# EAGLE design schematic (EAGLE 9.6.2)
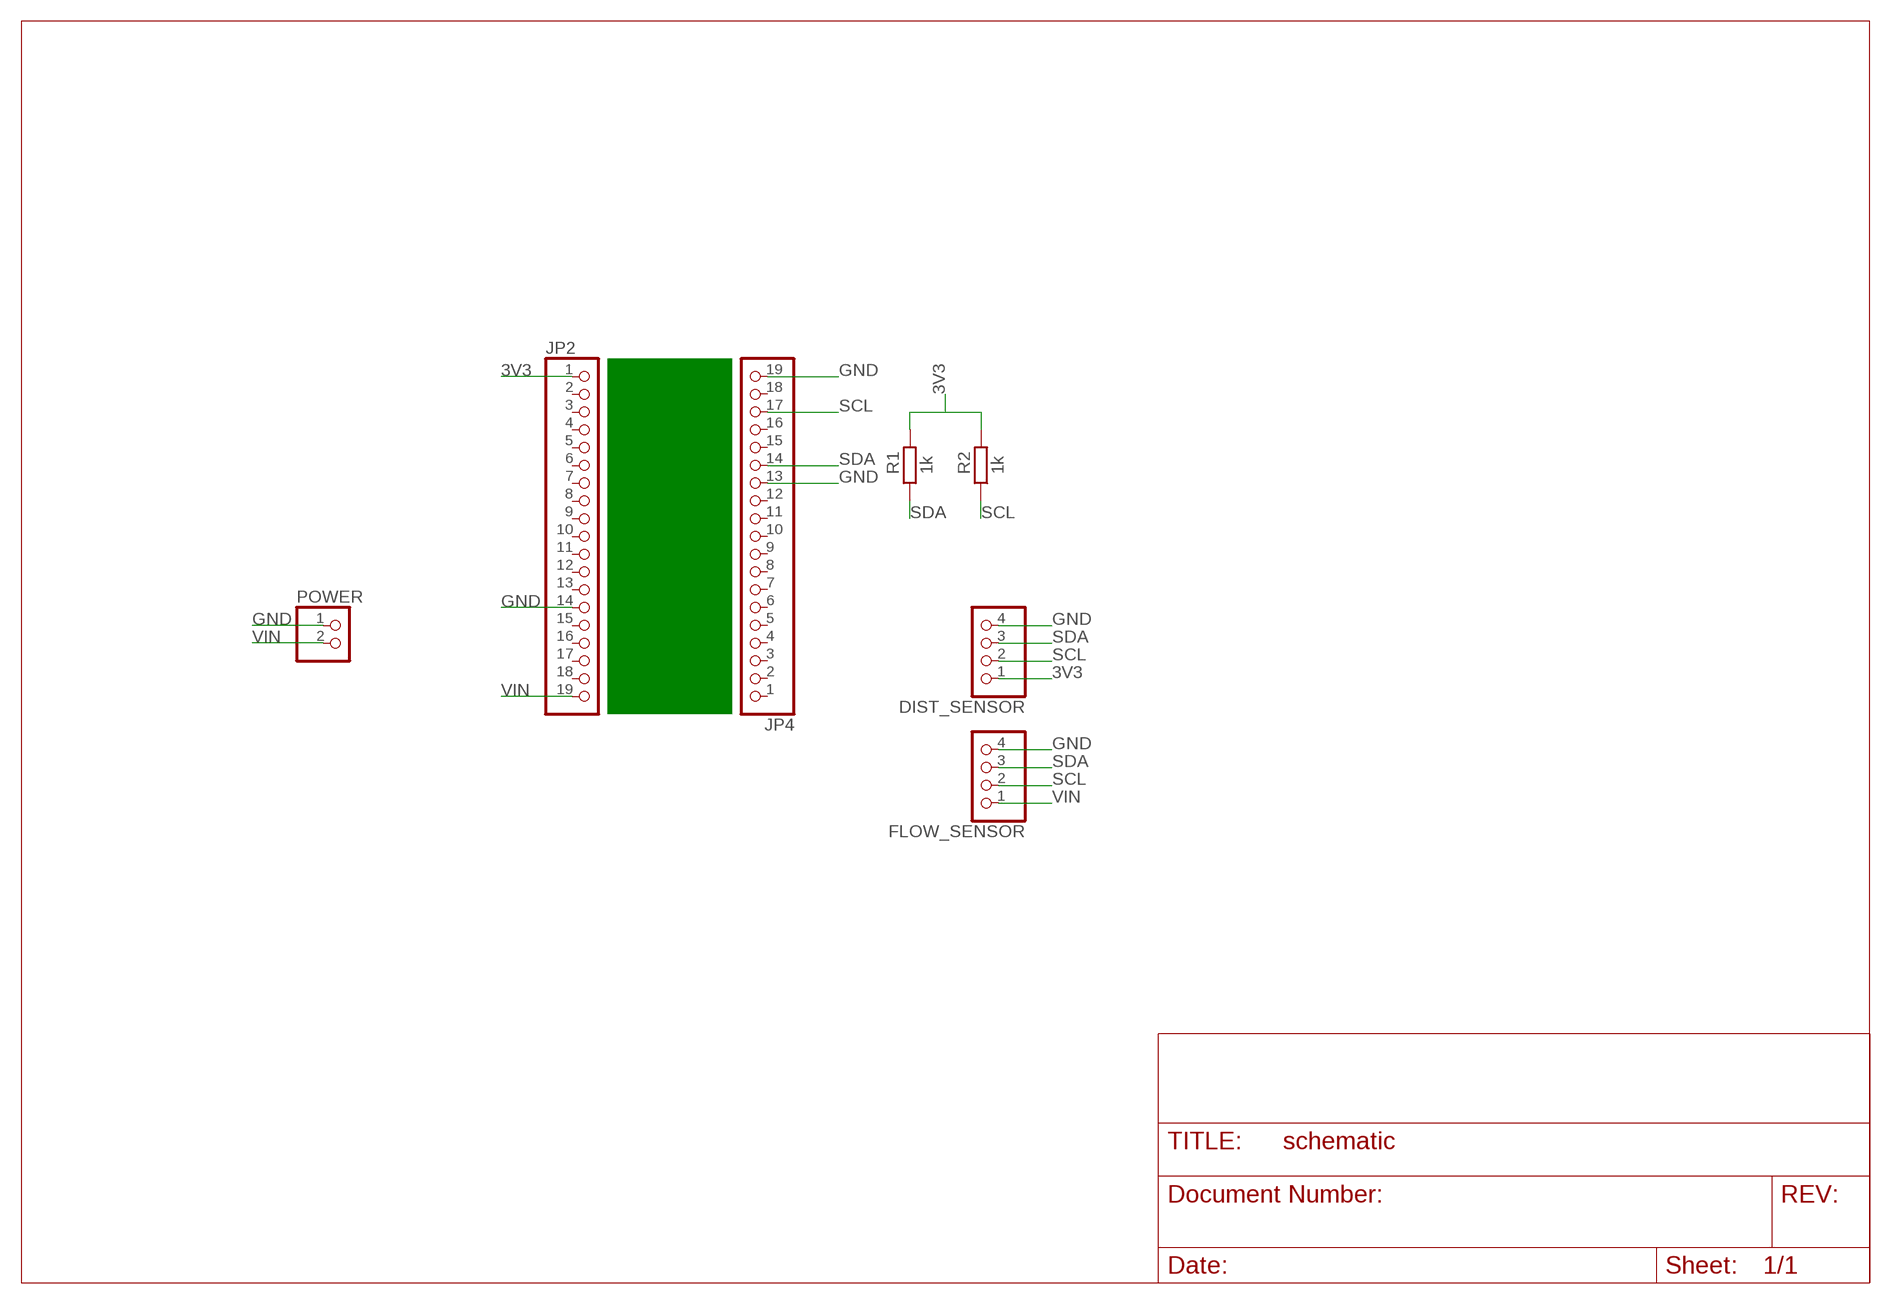
[diagram p0: schematic, sheet 1]

## Parts
DIST_SENSOR  PINHD-1X4  [1X04]
FLOW_SENSOR  PINHD-1X4  [1X04]
JP2  PINHD-1X19  [1X19]
JP4  PINHD-1X19  [1X19]
POWER  PINHD-1X2  [1X02]
R1  1k  R-EU_0207/10  [0207/10]
R2  1k  R-EU_0207/10  [0207/10]

## Nets
3V3: DIST_SENSOR.1 JP2.1 R1.2 R2.2
GND: DIST_SENSOR.4 FLOW_SENSOR.4 JP2.14 JP4.13 JP4.19 POWER.1
SCL: DIST_SENSOR.3 FLOW_SENSOR.3 JP4.17 R2.1
SDA: DIST_SENSOR.2 FLOW_SENSOR.2 JP4.14 R1.1
VIN: FLOW_SENSOR.1 JP2.19 POWER.2
Unconnected: JP2.2 JP2.3 JP2.4 JP2.5 JP2.6 JP2.7 JP2.8 JP2.9 JP2.10 JP2.11 JP2.12 JP2.13 JP2.15 JP2.16 JP2.17 JP2.18 JP4.1 JP4.2 JP4.3 JP4.4 JP4.5 JP4.6 JP4.7 JP4.8 JP4.9 JP4.10 JP4.11 JP4.12 JP4.15 JP4.16 JP4.18

## Library data of the parts
DIST_SENSOR FLOW_SENSOR = pinhead:PINHD-1X4: PIN HEADER
JP2 JP4 = pinhead:PINHD-1X19: PIN HEADER
POWER = pinhead:PINHD-1X2: PIN HEADER
R1 R2 = rcl:R-EU_: RESISTOR, European symbol; SPICEPREFIX: R

## Board
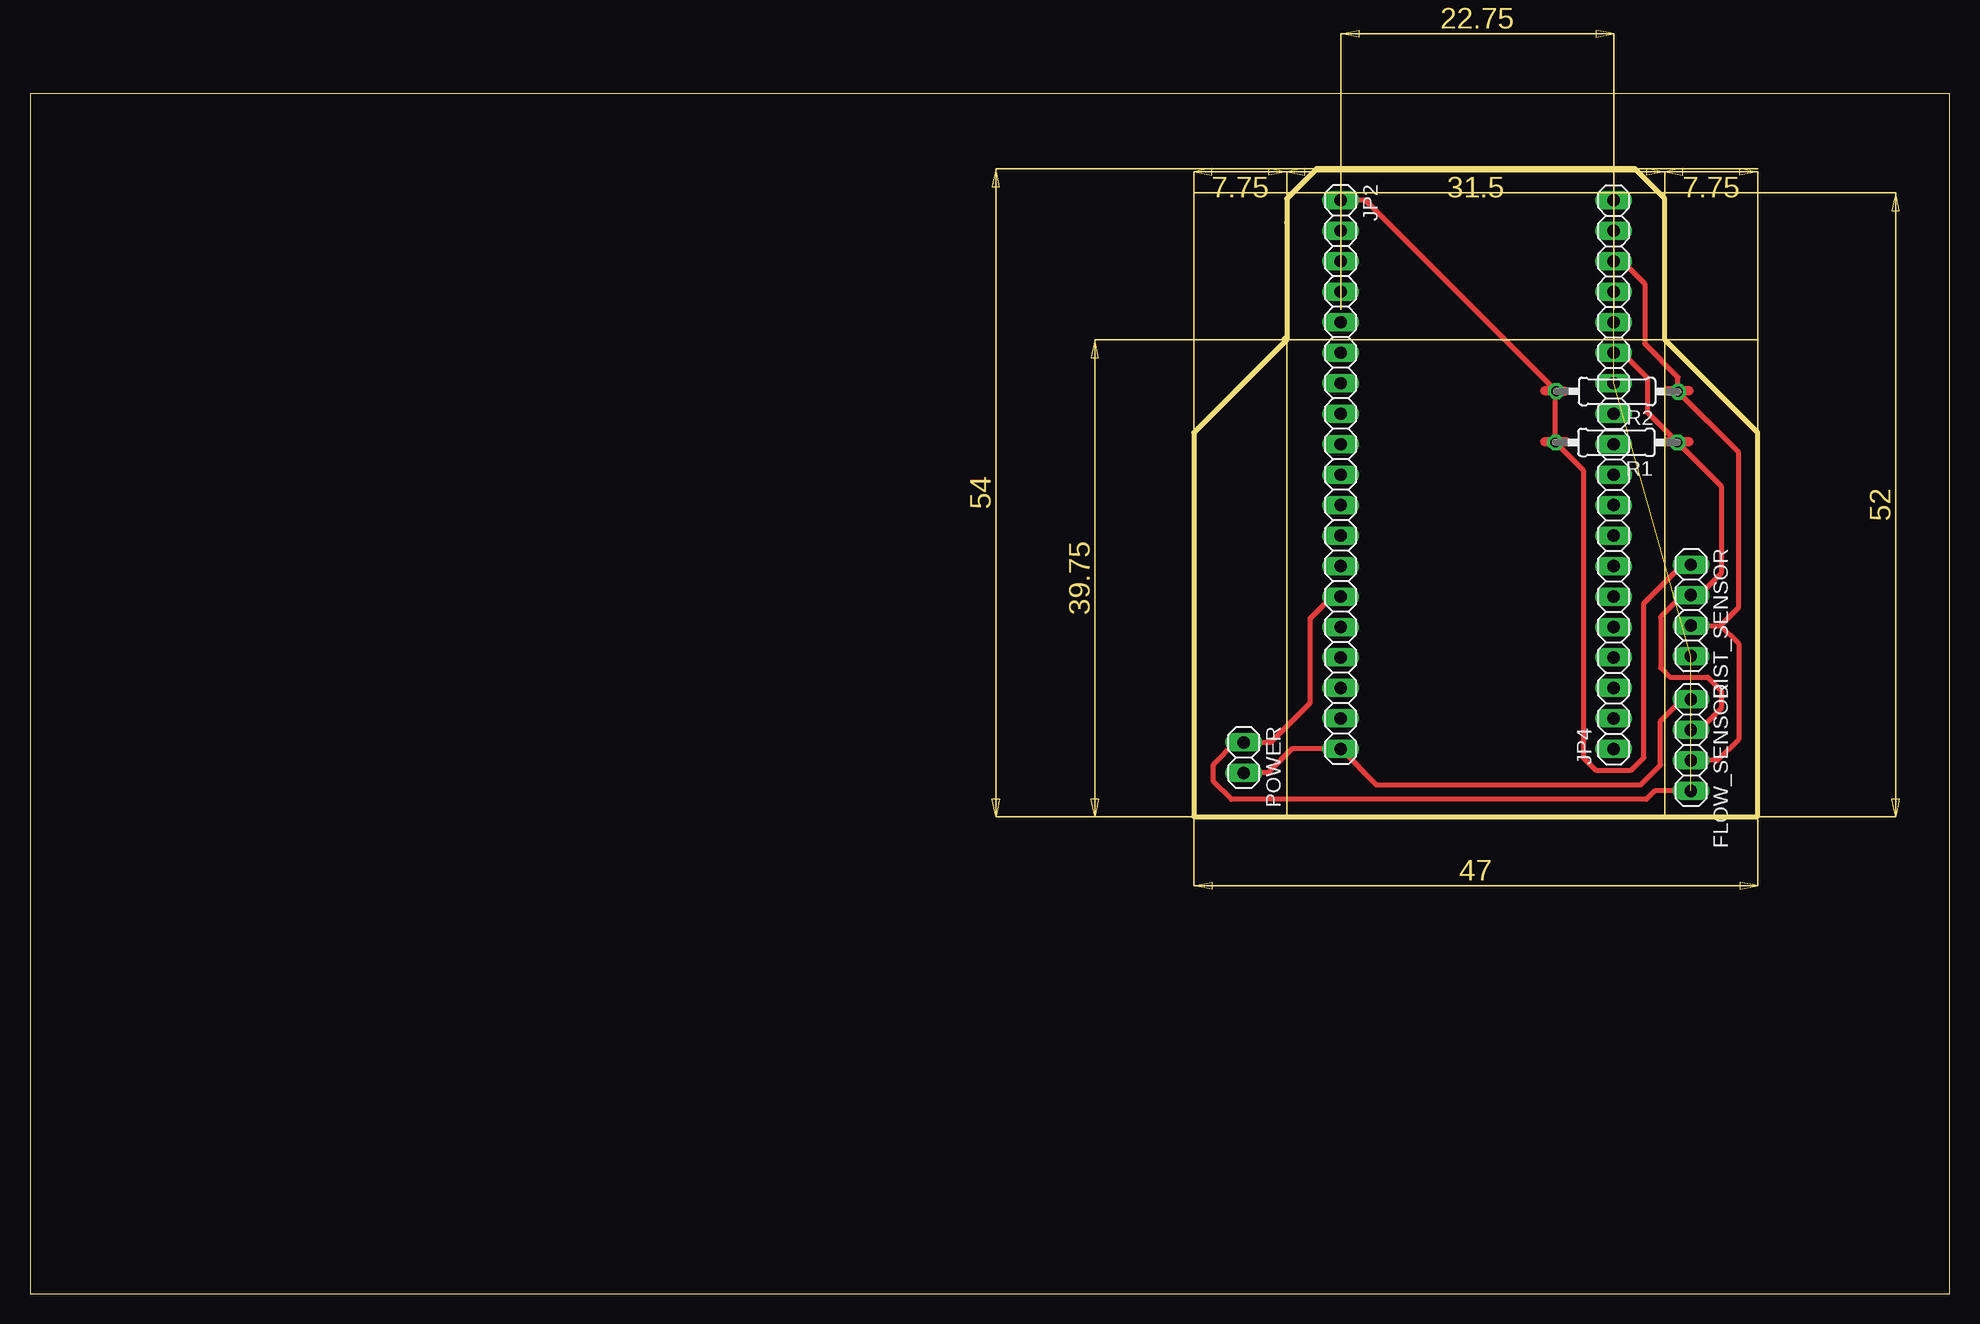
[diagram p1: board, top side]

Size 160 x 100 mm. Coordinates in mm from the lower left corner, seen from the top.
Outline: 104.75,89.25 104.75,79.5 97,71.75 97,39.75 144,39.75 144,71.75 136.25,79.5 136.25,91.25 133.75,93.75 107.25,93.75 104.75,91.25 104.75,79.75 104.5,79.5
Outline: 0,0 160,0 160,100 0,100 0,0
Copper layers (1*16): Top 0.035mm / dielectric 1.5mm / Bottom 0.035mm
Design rules "default *": minimum track width 0.4mm, minimum drill 0.35mm, track to track 0.8mm, track to pad 0.8mm, pad to pad 0.8mm, via to via 0.8mm, smd to smd 0.4mm, copper to edge 40mil, drill to drill 6mil, minimum pad ring 10mil, minimum via ring 8mil, stop-mask expansion 4mil, vias tented up to drill 0mil, thermal gap 10mil

### Footprints (pad centres in the part's own frame; a part is rotated, then mirrored left to right if it is on the bottom)
1X04 = drill 1.016 long: 1 -3.81,0; 2 -1.27,0; 3 1.27,0; 4 3.81,0
1X19 = drill 1.016 long: 1 -22.86,0; 2 -20.32,0; 3 -17.78,0; 4 -15.24,0; 5 -12.7,0; 6 -10.16,0; 7 -7.62,0; 8 -5.08,0; 9 -2.54,0; 10 0,0; 11 2.54,0; 12 5.08,0; 13 7.62,0; 14 10.16,0; 15 12.7,0; 16 15.24,0; 17 17.78,0; 18 20.32,0; 19 22.86,0
1X02 = drill 1.016 long: 1 -1.27,0; 2 1.27,0
0207/10 = drill 0.813 octagon: 1 -5.08,0; 2 5.08,0

### Placement (x,y rotation side)
DIST_SENSOR  138.45,56.94 270 top
FLOW_SENSOR  138.45,45.7 270 top
JP2  109.25,68.25 270 top
JP4  132,68.25 90 top
POWER  101.17,44.66 270 top
R1  132.23,70.93 180 top
R2  132.29,75.18 179.8 top

### Tracks (layer width: path | path; a pad name or v marks a point on that pad's centre or on a via)
3V3
  Top 0.4: R1.2 127.15,75.14 R2.2 | R2.2 111.3,91.11 JP2.1 | R1.2 129.48,68.6 129.48,44.66 130.51,43.63 133.49,43.63 134.52,44.66 134.52,57.54 137.74,60.75 DIST_SENSOR.1 | R1.2 127.08,71 | R1.2 127.22,71 | R2.2 127.26,75.25 128,75.25 127.95,75.2 | R2.2 127.16,75.25
  Top 0.8: 127.08,71 126.25,71 | 128,71 127.22,71 | 127.95,75.2 R2.2 | 127.16,75.25 126.25,75.25
GND  (3 unrouted)
  Top 0.4: 138.2,41.64 FLOW_SENSOR.4 135.45,41.89 134.74,41.18 100.13,41.18 98.65,42.66 98.65,44.12 100.46,45.93 POWER.1 103.42,45.93 106.73,49.24 106.73,56.28 108.54,58.09 JP2.14
SCL
  Top 0.4: FLOW_SENSOR.3 140.66,44.43 142.47,46.24 142.47,54.11 140.91,55.67 | 140.91,55.67 142.42,57.18 142.42,70.11 R2.1 | DIST_SENSOR.3 140.91,55.67 | JP4.17 132.71,86.03 134.58,84.16 134.58,79.16 137.37,76.38 R2.1 | 137.46,75.25 R2.1 | R2.1 137.28,75.25
  Top 0.8: 138.25,75.25 137.46,75.25 | 137.28,75.25 136.51,75.25
SDA  (1 unrouted)
  Top 0.4: 138.48,47 139.19,47 140.97,48.78 140.97,50.24 139.85,51.37 136.71,51.37 135.93,52.15 135.93,56.4 137.74,58.21 DIST_SENSOR.2 139.16,58.21 140.97,60.02 140.97,67.27 R1.1 134.81,73.43 134.81,76.31 132.71,78.41 JP4.14
  Top 0.8: 136.5,71 137.24,71 R1.1 137.38,71 138.25,71
VIN
  Top 0.4: FLOW_SENSOR.1 137.74,49.51 135.9,47.68 135.9,44.04 134.24,42.38 112.26,42.38 JP2.19 105.17,45.39 103.17,43.39 POWER.2